# Altium schematic sheet GNSS.SchDoc (part 1 of 3)
size A2; SheetNumber: 1; SheetTotal: 1
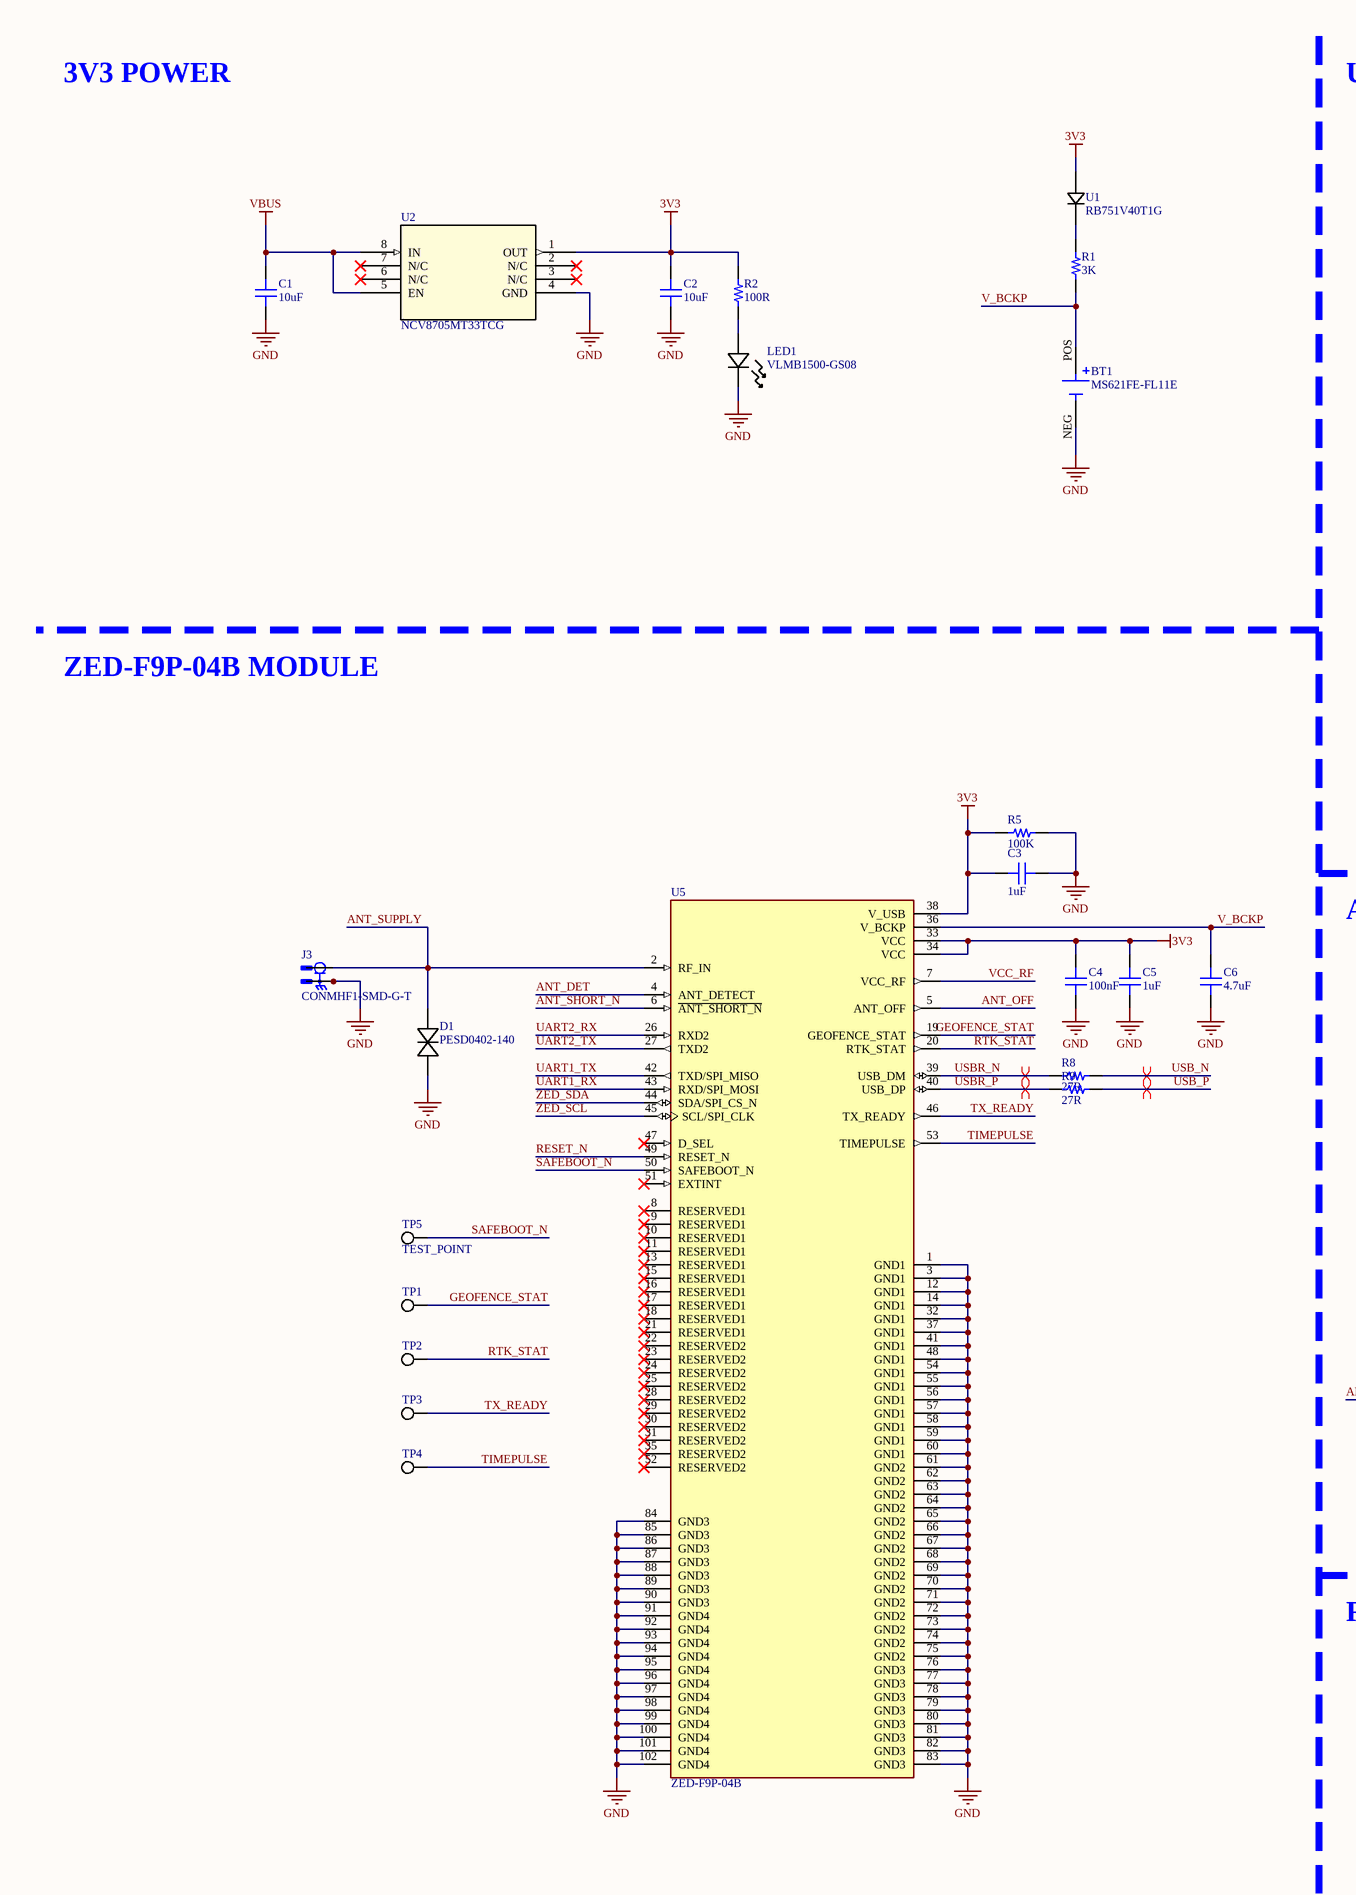
[diagram p0: GNSS.SchDoc, left]
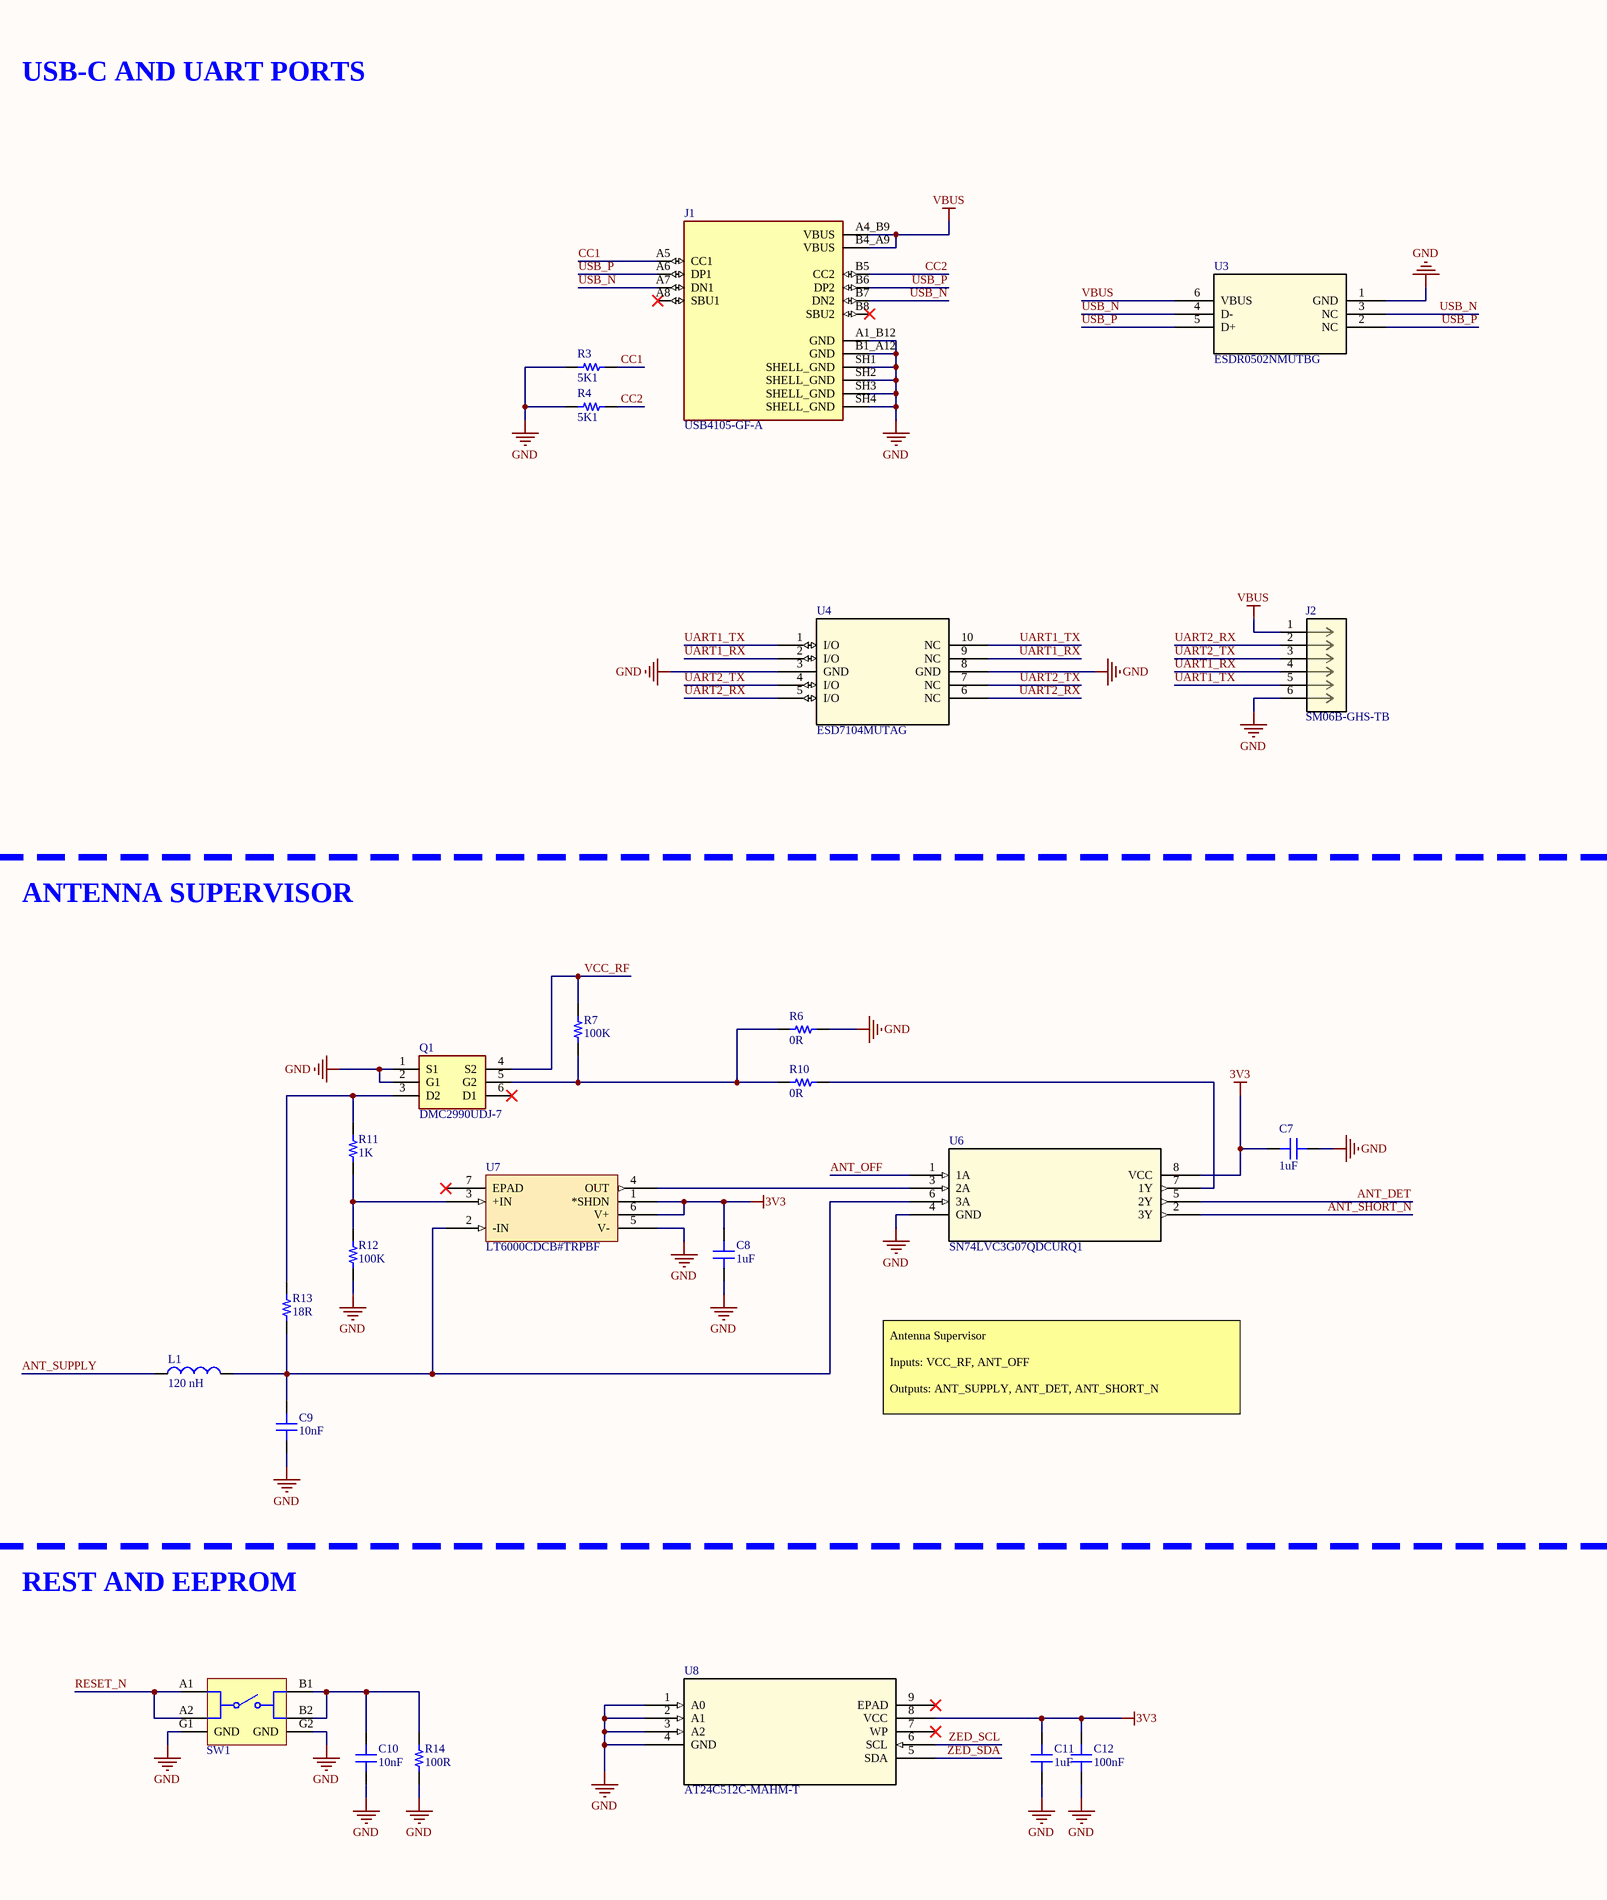
[diagram p1: GNSS.SchDoc, right]

## Parts
BT1  MS621FE-FL11E  [BAT_MS621FE-FL11E]
C1  10uF  [CAP 0402_1005]
C2  10uF  [CAP 0402_1005]
C3  1uF  [CAP 0402_1005]
C4  100nF  [CAP 0402_1005]
C5  1uF  [CAP 0402_1005]
C6  4.7uF  [CAP 0603_1608]
C7  1uF  [CAP 0402_1005]
C8  1uF  [CAP 0402_1005]
C9  10nF  [CAP 0402_1005]
C10  10nF  [CAP 0402_1005]
C11  1uF  [CAP 0402_1005]
C12  100nF  [CAP 0402_1005]
D1  PESD0402-140  [PESD0402-140_LTF]
J1  USB4105-GF-A  [GCT_USB4105-GF-A]
J2  SM06B-GHS-TB  [CONN_SM06B-GHS-TB_JST]
J3  CONMHF1-SMD-G-T  [LINX_CONMHF1-SMD-G-T]
L1  120 nH  [INDC1005X60N]
LED1  VLMB1500-GS08  [LED_500-GS08_VIS]
Q1  DMC2990UDJ-7  [SOTFL35P100X50-6N]
R1  3K  [RES 0402_1005]
R2  100R  [RES 0402_1005]
R3  5K1  [RES 0402_1005]
R4  5K1  [RES 0402_1005]
R5  100K  [RES 0402_1005]
R6  0R  [RES 0402_1005]
R7  100K  [RES 0402_1005]
R8  27R  [RES 0402_1005]
R9  27R  [RES 0402_1005]
R10  0R  [RES 0402_1005]
R11  1K  [RES 0402_1005]
R12  100K  [RES 0402_1005]
R13  18R  [RES 0402_1005]
R14  100R  [RES 0402_1005]
SW1  435151014845  [435151014845]  (value not drawn)
TP1  TEST_POINT  [TEST_POINT]  (value not drawn)
TP2  TEST_POINT  [TEST_POINT]  (value not drawn)
TP3  TEST_POINT  [TEST_POINT]  (value not drawn)
TP4  TEST_POINT  [TEST_POINT]  (value not drawn)
TP5  TEST_POINT  [TEST_POINT]
U1  RB751V40T1G  [SOD-323_1P8X1P35_ONS]
U2  NCV8705MT33TCG  [WDFN6_2X2_ONS]
U3  ESDR0502NMUTBG  [UDFN6_517AA_ONS]
U4  ESD7104MUTAG  [UDFN10_ONS_ESD]
U5  ZED-F9P-04B  [MODULE_ZED-F9P-04B]
U6  SN74LVC3G07QDCURQ1  [DCU8_TEX_SN74]
U7  LT6000CDCB#TRPBF  [DFN-6_DCB]
U8  AT24C512C-MAHM-T  [8MA2_ATM_EEPROM]

## Nets
3V3: C2.2 C3.2 C4.2 C5.2 C7.2 C8.2 C11.1 C12.1 R2.2 R5.2 U1.2 U2.1(OUT) U5.33(VCC) U5.34(VCC) U5.38(V_USB) U6.8(VCC) U7.1(*SHDN) U7.6(V+) U8.8(VCC)
GND: BT1.NEG C1.1 C2.1 C3.1 C4.1 C5.1 C6.2 C7.1 C8.1 C9.1 C10.1 C11.2 C12.2 D1.2 J1.A1_B12(GND) J1.B1_A12(GND) J1.SH1(SHELL_GND) J1.SH2(SHELL_GND) J1.SH3(SHELL_GND) J1.SH4(SHELL_GND) J2.6 J3.S1 J3.S2 J3.S3 LED1.1 Q1.1(S1) Q1.2(G1) R3.2 R4.1 R5.1 R6.2 R12.1 R14.1 SW1.G1(GND) SW1.G2(GND) U2.4(GND) U3.1(GND) U4.3(GND) U4.8(GND) U5.1(GND1) U5.3(GND1) U5.12(GND1) U5.14(GND1) U5.32(GND1) U5.37(GND1) U5.41(GND1) U5.48(GND1) U5.54(GND1) U5.55(GND1) U5.56(GND1) U5.57(GND1) U5.58(GND1) U5.59(GND1) U5.60(GND1) U5.61(GND2) U5.62(GND2) U5.63(GND2) U5.64(GND2) U5.65(GND2) U5.66(GND2) U5.67(GND2) U5.68(GND2) U5.69(GND2) U5.70(GND2) U5.71(GND2) U5.72(GND2) U5.73(GND2) U5.74(GND2) U5.75(GND2) U5.76(GND3) U5.77(GND3) U5.78(GND3) U5.79(GND3) U5.80(GND3) U5.81(GND3) U5.82(GND3) U5.83(GND3) U5.84(GND3) U5.85(GND3) U5.86(GND3) U5.87(GND3) U5.88(GND3) U5.89(GND3) U5.90(GND3) U5.91(GND4) U5.92(GND4) U5.93(GND4) U5.94(GND4) U5.95(GND4) U5.96(GND4) U5.97(GND4) U5.98(GND4) U5.99(GND4) U5.100(GND4) U5.101(GND4) U5.102(GND4) U6.4(GND) U7.5(V-) U8.1(A0) U8.2(A1) U8.3(A2) U8.4(GND)
VBUS: C1.2 J1.A4_B9(VBUS) J1.B4_A9(VBUS) J2.1 U2.5(EN) U2.8(IN) U3.6(VBUS)
ANT_DET: U5.4(ANT_DETECT) U6.5(2Y)
ANT_OFF: U5.5(ANT_OFF) U6.1(1A)
ANT_SHORT_N: U5.6(~{ANT_SHORT_N}) U6.2(3Y)
ANT_SUPPLY: D1.1 J3.1 L1.1 U5.2(RF_IN)
CC1: J1.A5(CC1) R3.1
CC2: J1.B5(CC2) R4.2
GEOFENCE_STAT: TP1.1 U5.19(GEOFENCE_STAT)
RESET_N: SW1.A1 SW1.A2 U5.49(RESET_N)
RTK_STAT: TP2.1 U5.20(RTK_STAT)
SAFEBOOT_N: TP5.1 U5.50(SAFEBOOT_N)
TIMEPULSE: TP4.1 U5.53(TIMEPULSE)
TX_READY: TP3.1 U5.46(TX_READY)
UART1_RX: J2.4 U4.2(I/O) U4.9(NC) U5.43(RXD/SPI_MOSI)
UART1_TX: J2.5 U4.1(I/O) U4.10(NC) U5.42(TXD/SPI_MISO)
UART2_RX: J2.2 U4.5(I/O) U4.6(NC) U5.26(RXD2)
UART2_TX: J2.3 U4.4(I/O) U4.7(NC) U5.27(TXD2)
USB_N: J1.A7(DN1) J1.B7(DN2) R8.2 U3.3(NC) U3.4(D-)
USB_P: J1.A6(DP1) J1.B6(DP2) R9.2 U3.2(NC) U3.5(D+)
USBR_N: R8.1 U5.39(USB_DM)
USBR_P: R9.1 U5.40(USB_DP)
V_BCKP: BT1.POS C6.1 R1.1 U5.36(V_BCKP)
VCC_RF: Q1.4(S2) R7.2 U5.7(VCC_RF)
ZED_SCL: U5.45(SCL/SPI_CLK) U8.6(SCL)
ZED_SDA: U5.44(SDA/SPI_CS_N) U8.5(SDA)
NetC9_2: C9.2 L1.2 R13.1 U6.6(3A) U7.2(-IN)
NetC10_2: C10.2 R14.2 SW1.B1 SW1.B2
NetLED1_2: LED1.2 R2.1
NetQ1_3: Q1.3(D2) R11.2 R13.2
NetQ1_5: Q1.5(G2) R6.1 R7.1 R10.1
NetR1_2: R1.2 U1.1
NetR10_2: R10.2 U6.7(1Y)
NetR11_1: R11.1 R12.2 U7.3(+IN)
NetU6_3: U6.3(2A) U7.4(OUT)

Not connected (* = marked no-connect by the designer): J1 A8(SBU1)* B8(SBU2)*; Q1 6(D1)*; U2 2(N/C)* 3(N/C)* 6(N/C)* 7(N/C)*; U5 8(RESERVED1)* 9(RESERVED1)* 10(RESERVED1)* 11(RESERVED1)* 13(RESERVED1)* 15(RESERVED1)* 16(RESERVED1)* 17(RESERVED1)* 18(RESERVED1)* 21(RESERVED1)* 22(RESERVED2)* 23(RESERVED2)* 24(RESERVED2)* 25(RESERVED2)* 28(RESERVED2)* 29(RESERVED2)* 30(RESERVED2)* 31(RESERVED2)* 35(RESERVED2)* 47(D_SEL)* 51(EXTINT)* 52(RESERVED2)*; U7 7(EPAD)*; U8 7(WP)* 9(EPAD)*

## Layout directives
differential pair: USB_N, USB_P, USBR_N, USBR_P

## Notes on the sheet
- 3V3 POWER
- USB-C AND UART PORTS
- ZED-F9P-04B MODULE
- ANTENNA SUPERVISOR
- Antenna Supervisor
  Inputs: VCC_RF, ANT_OFF
  Outputs: ANT_SUPPLY, ANT_DET, ANT_SHORT_N
- REST AND EEPROM